# EasyEDA schematic seedrum_ph_v1.json
TITLE: Seedup PH; REV: 1.0; Date: 2020-10-29; Sheet: 1/1; Drawn By: victor.halla; Company: Seedup
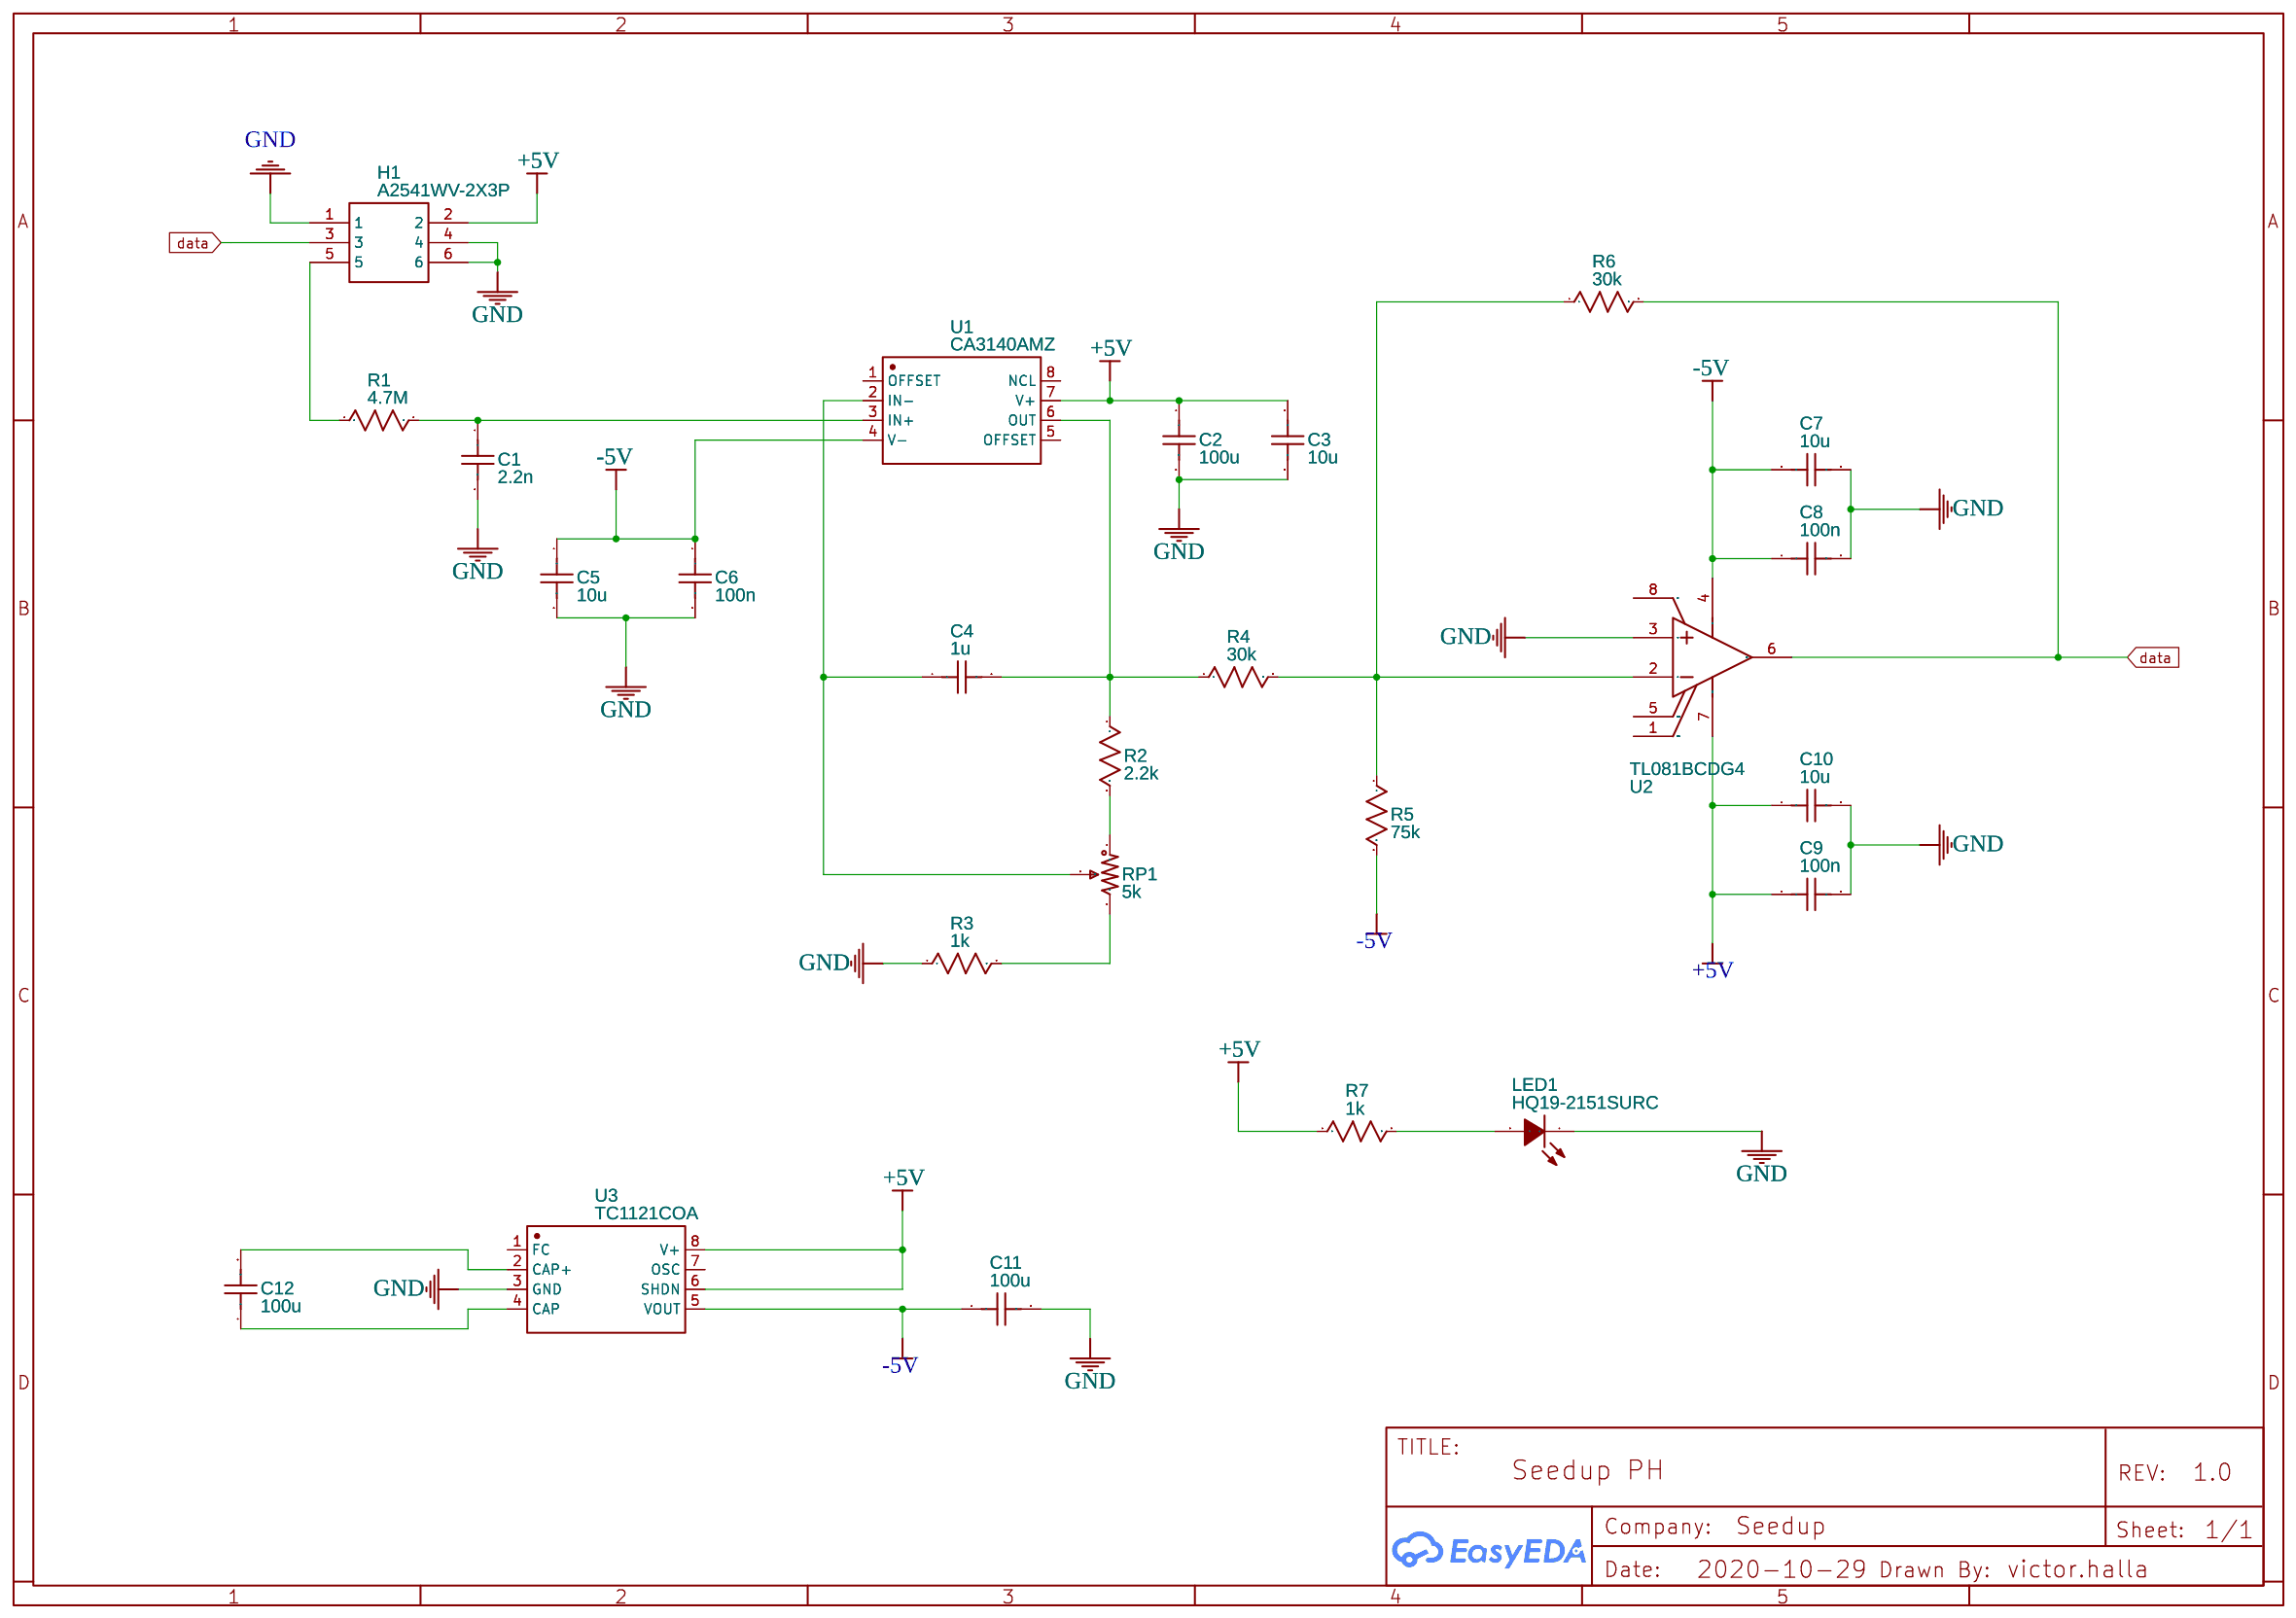
[diagram p0: schematic sheet]

## Parts
C1  2.2n  [C0603]
C2  100u  [C0603]
C3  10u  [C0603]
C4  1u  [C0603]
C5  10u  [C0603]
C6  100n  [C0603]
C7  10u  [C0603]
C8  100n  [C0603]
C9  100n  [C0603]
C10  10u  [C0603]
C11  100u  [C0603]
C12  100u  [C0603]
H1  A2541WV-2X3P  [HDR-TH_6P-P2.54-V-R2-C3-S2.54_A2541WV-2X3P]
LED1  HQ19-2151SURC  [LED0603-RD]
R1  4.7M  [R0603]
R2  2.2k  [R0603]
R3  1k  [R0603]
R4  30k  [R0603]
R5  75k  [R0603]
R6  30k  [R0603]
R7  1k  [R0603]
RP1  5k  [RES-ADJ-TH_3386P]
U1  CA3140AMZ  [SOP-8_L5.0-W4.0-P1.27-LS6.0-BL]
U2  TL081BCDG4  [SOIC8]
U3  TC1121COA  [SOIC-8]

## Library data of the parts
C1-C12 = C_0603_US: Contributor: LCEDA_Lib
H1 = A2541WV-2X3P: Supplier: LCSC; Supplier Part: C225518; Manufacturer: Changjiang Connectors; Manufacturer Part: A2541WV-2x3P; Contributor: LCSC
LED1 = HQ19-2151SURC: Supplier: LCSC; Supplier Part: C258842; Manufacturer: Harvatek Optoelectronics (Shenzhen); Contributor: LCSC
R1-R7 = R_0603_US: Contributor: LCEDA_Lib
RP1 = R_3386P_US: Supplier: LCSC; Contributor: LCEDA_Lib; value(Ω): 10K
U1 = CA3140AMZ: Supplier: LCSC; Manufacturer: ADI; Manufacturer Part: AD8052ARZ; Supplier Part: C86654; LCSC Assembly: Yes; SMT Type: Extend
U2 = TL081BCDG4: JFET-Input Operational Amplifier, 7 to 36 V, 0 to 70 degC, 8-pin SOIC (D8), Green (RoHS  no SbBr)
U3 = TC1121COA

## Nets
+5V: C2.1 C3.1 C9.1 C10.1 H1.2 R7.1 U1.7(V+) U2.7(VCC+) U3.6(SHDN) U3.8(V+)
-5V: C5.1 C6.1 C7.1 C8.1 C11.1 R5.2 U1.4(V-) U2.4(VCC-) U3.5(VOUT)
GND: C1.2 C2.2 C3.2 C5.2 C6.2 C7.2 C8.2 C9.2 C10.2 C11.2 H1.1 H1.4 H1.6 LED1.1(K) R3.1 U2.3(IN+) U3.3(GND)
data: H1.3 R6.2 U2.6(OUT)
Net-(C1-1): C1.1 R1.2 U1.3(IN+)
Net-(C4-1): C4.1 RP1.2 U1.2(IN-)
Net-(C4-2): C4.2 R2.1 R4.1 U1.6(OUT)
Net-(C12-1): C12.1 U3.4(CAP)
Net-(C12-2): C12.2 U3.2(CAP+)
Net-(H1-5): H1.5 R1.1
Net-(LED1-2): LED1.2(A) R7.2
Net-(R2-2): R2.2 RP1.1
Net-(R3-2): R3.2 RP1.3
Net-(R4-2): R4.2 R5.1 R6.1 U2.2(IN-)

Not connected (* = marked no-connect by the designer): U1 1(OFFSET) 5(OFFSET) 8(NCL); U2 1(OFFSET N1) 5(OFFSET N2) 8(NC); U3 1(FC) 7(OSC)
